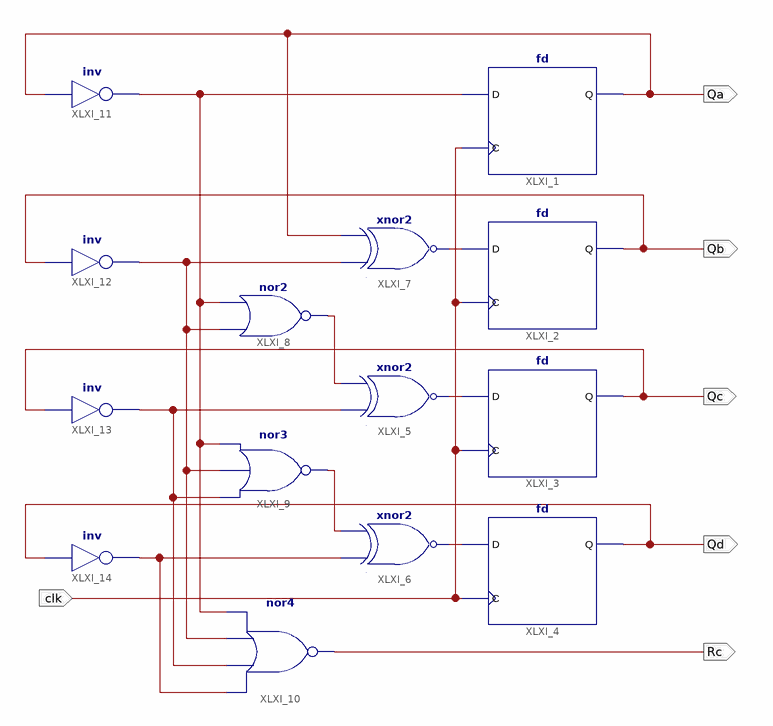
[diagram p0: schematic sheet 1]
// Xilinx ISE schematic Counter4b.sch (kintex7) as structural Verilog: 14 symbols, 6 ports
module Counter4b (
  input  clk,
  output Qd,
  output Rc,
  output Qc,
  output Qb,
  output Qa
);

  wire XLXN_5, XLXN_6, XLXN_7, XLXN_8, XLXN_9, XLXN_18, XLXN_19, XLXN_22, XLXN_26;

  nor XLXI_10 (Rc, XLXN_26, XLXN_22, XLXN_19, XLXN_18);
  not XLXI_14 (XLXN_26, Qd);
  not XLXI_13 (XLXN_22, Qc);
  not XLXI_12 (XLXN_19, Qb);
  not XLXI_11 (XLXN_18, Qa);
  nor XLXI_9 (XLXN_9, XLXN_22, XLXN_19, XLXN_18);
  nor XLXI_8 (XLXN_8, XLXN_19, XLXN_18);
  xnor XLXI_7 (XLXN_7, XLXN_19, Qa);
  xnor XLXI_6 (XLXN_6, XLXN_26, XLXN_9);
  xnor XLXI_5 (XLXN_5, XLXN_22, XLXN_8);
  fd XLXI_4 (.C(clk), .D(XLXN_6), .Q(Qd));
  fd XLXI_3 (.C(clk), .D(XLXN_5), .Q(Qc));
  fd XLXI_2 (.C(clk), .D(XLXN_7), .Q(Qb));
  fd XLXI_1 (.C(clk), .D(XLXN_18), .Q(Qa));
endmodule
